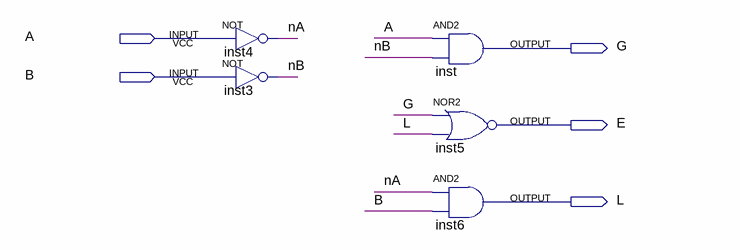
[diagram p0: schematic sheet]
// Quartus schematic CMP1.bdf as structural Verilog: 5 symbols, 5 pins
module CMP1 (
  input  A,
  input  B,
  output G,
  output E,
  output L
);

  wire nA, nB;

  not inst4 (nA, A);
  not inst3 (nB, B);
  and inst (G, A, nB);
  nor inst5 (E, G, L);
  and inst6 (L, nA, B);
endmodule
